# EAGLE design 3_ESC_BOARD (EAGLE 8.3.2)
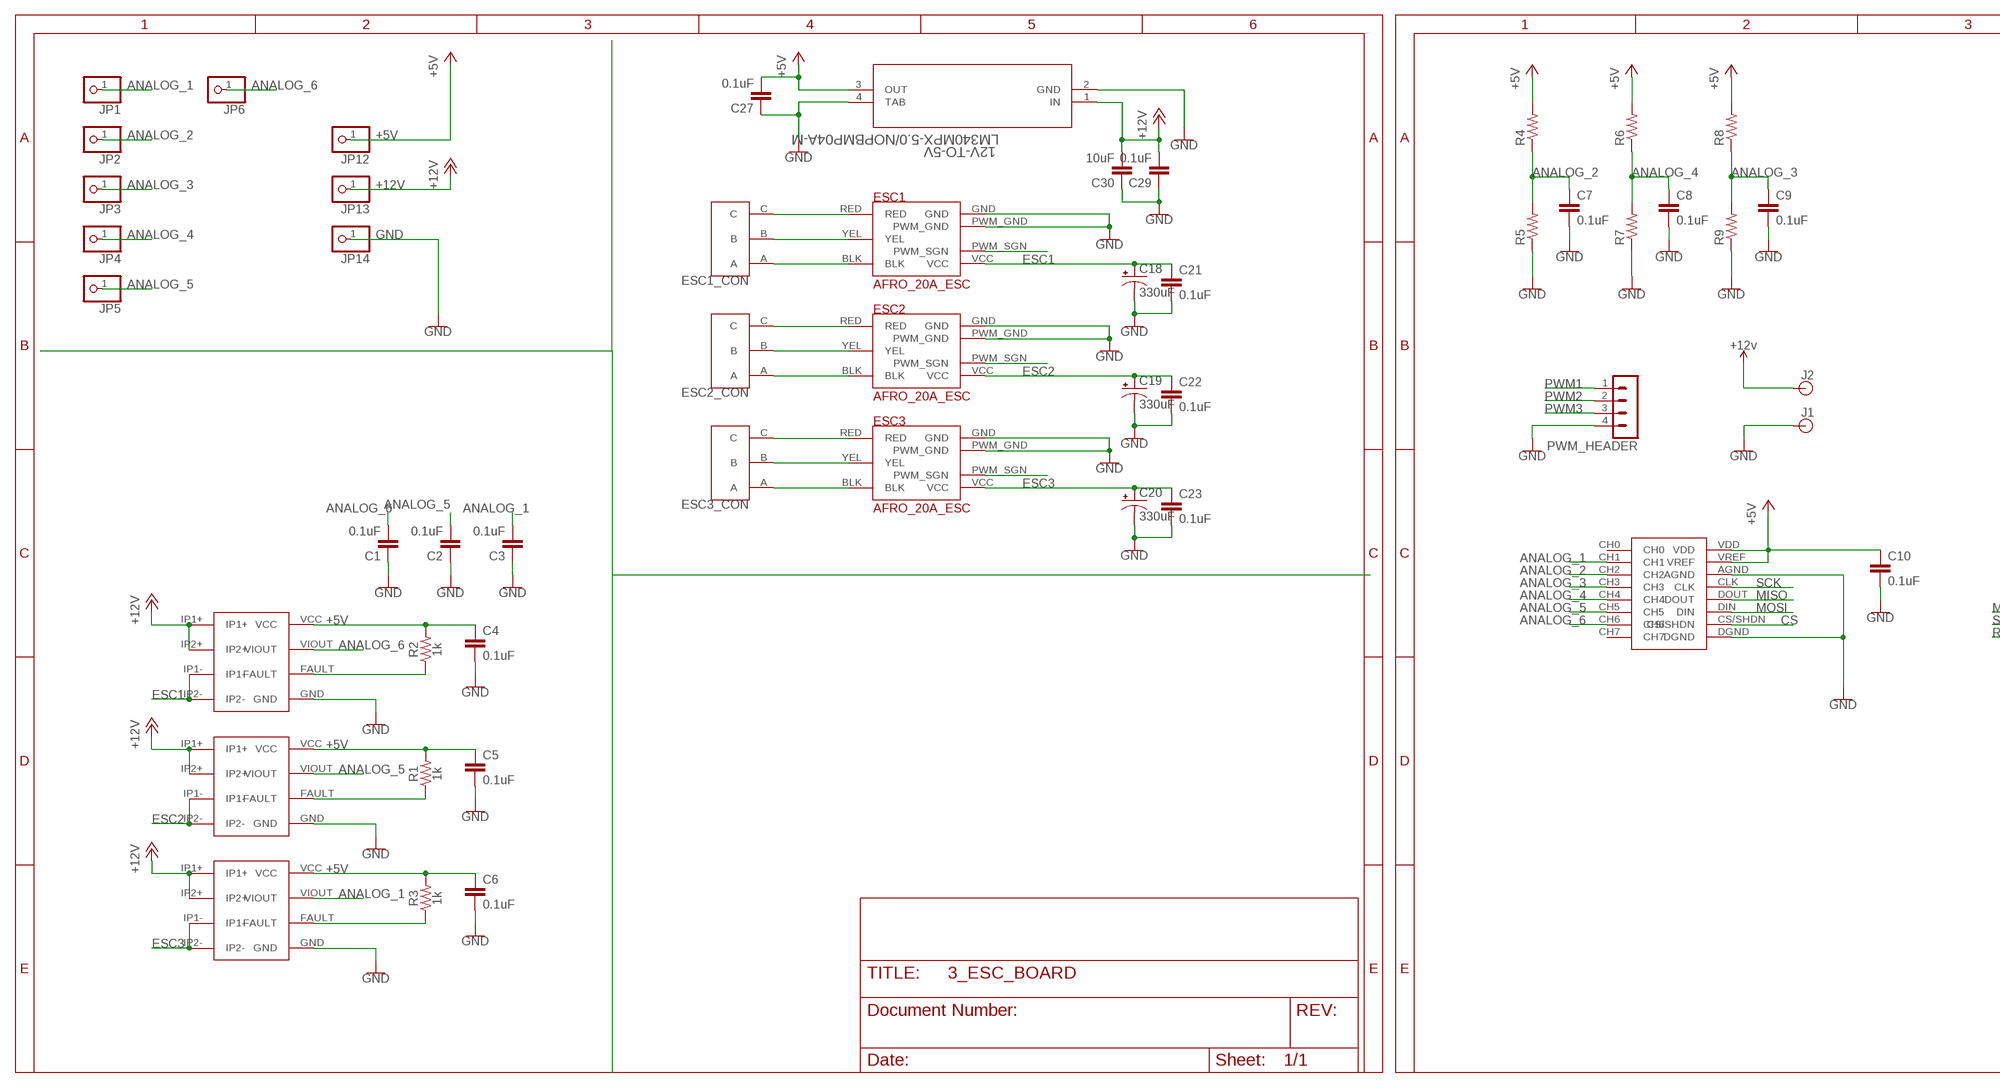
[diagram p0: schematic, sheet 1, part 1 of 3]
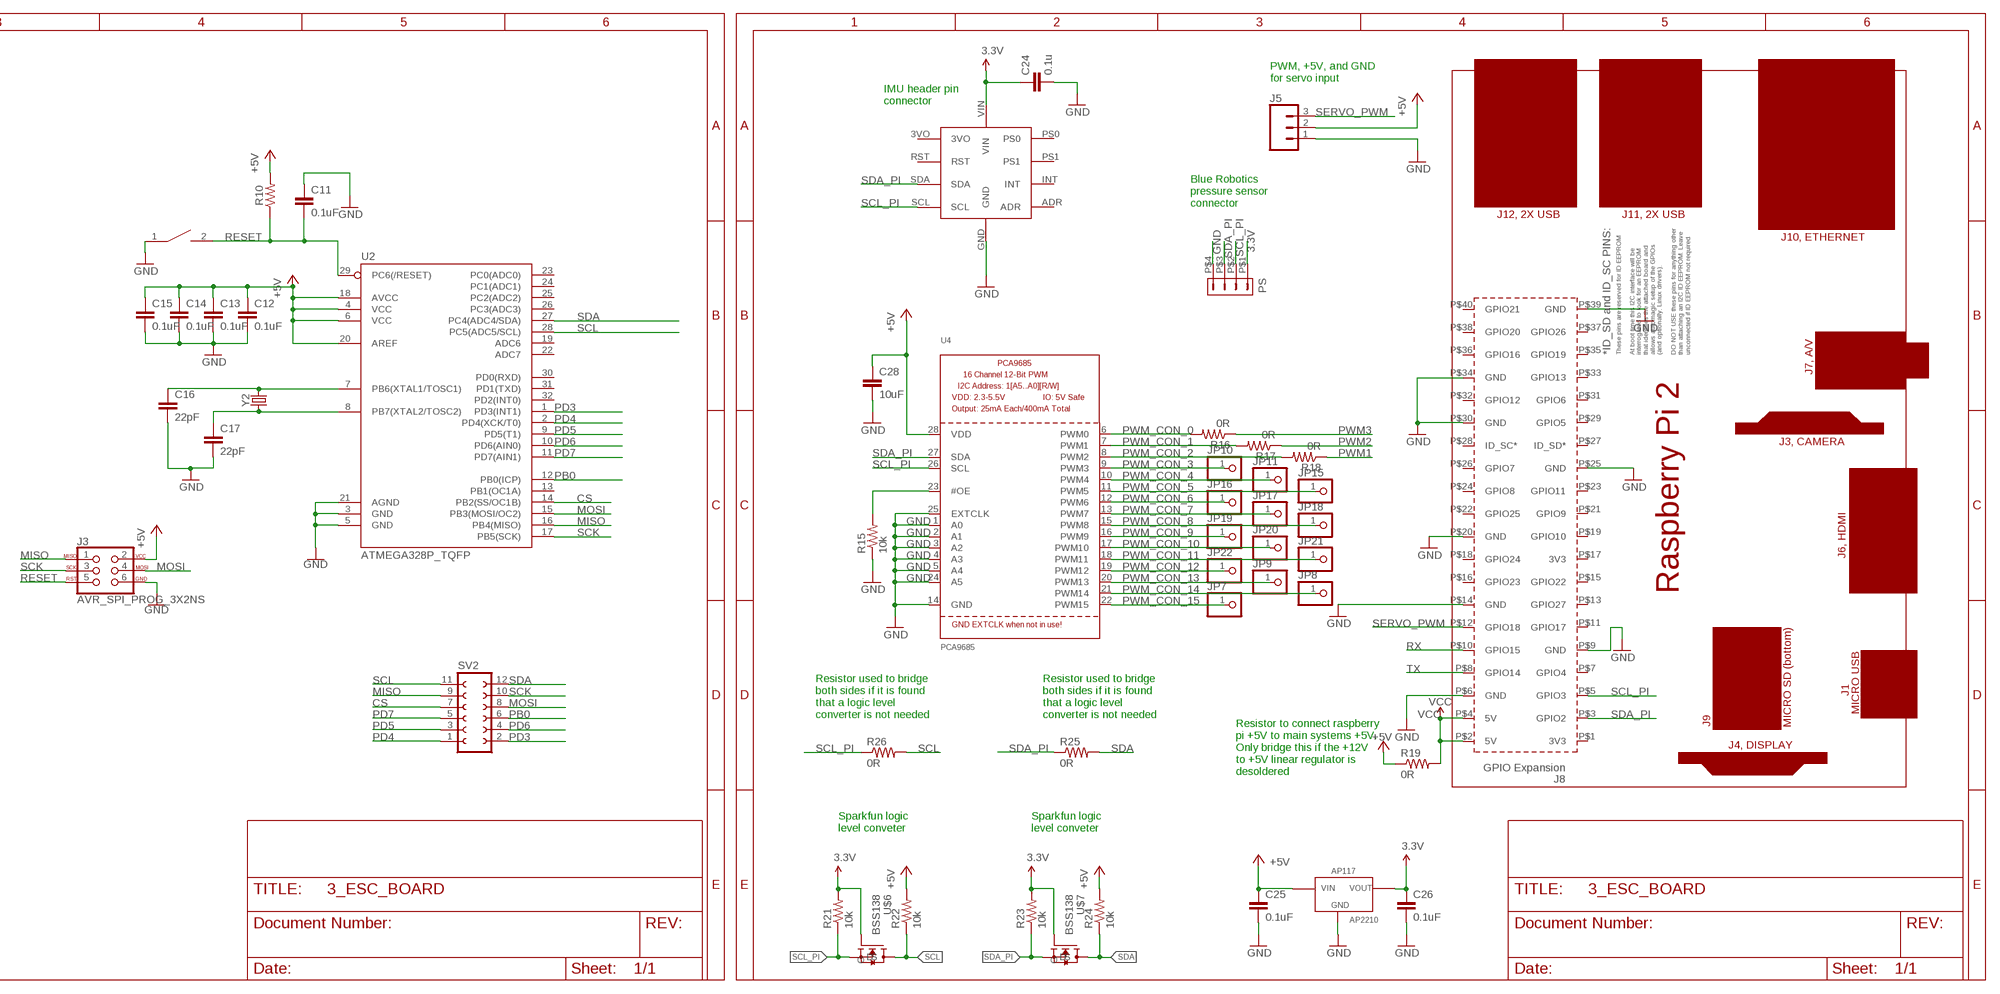
[diagram p1: schematic, sheet 1, part 2 of 3]
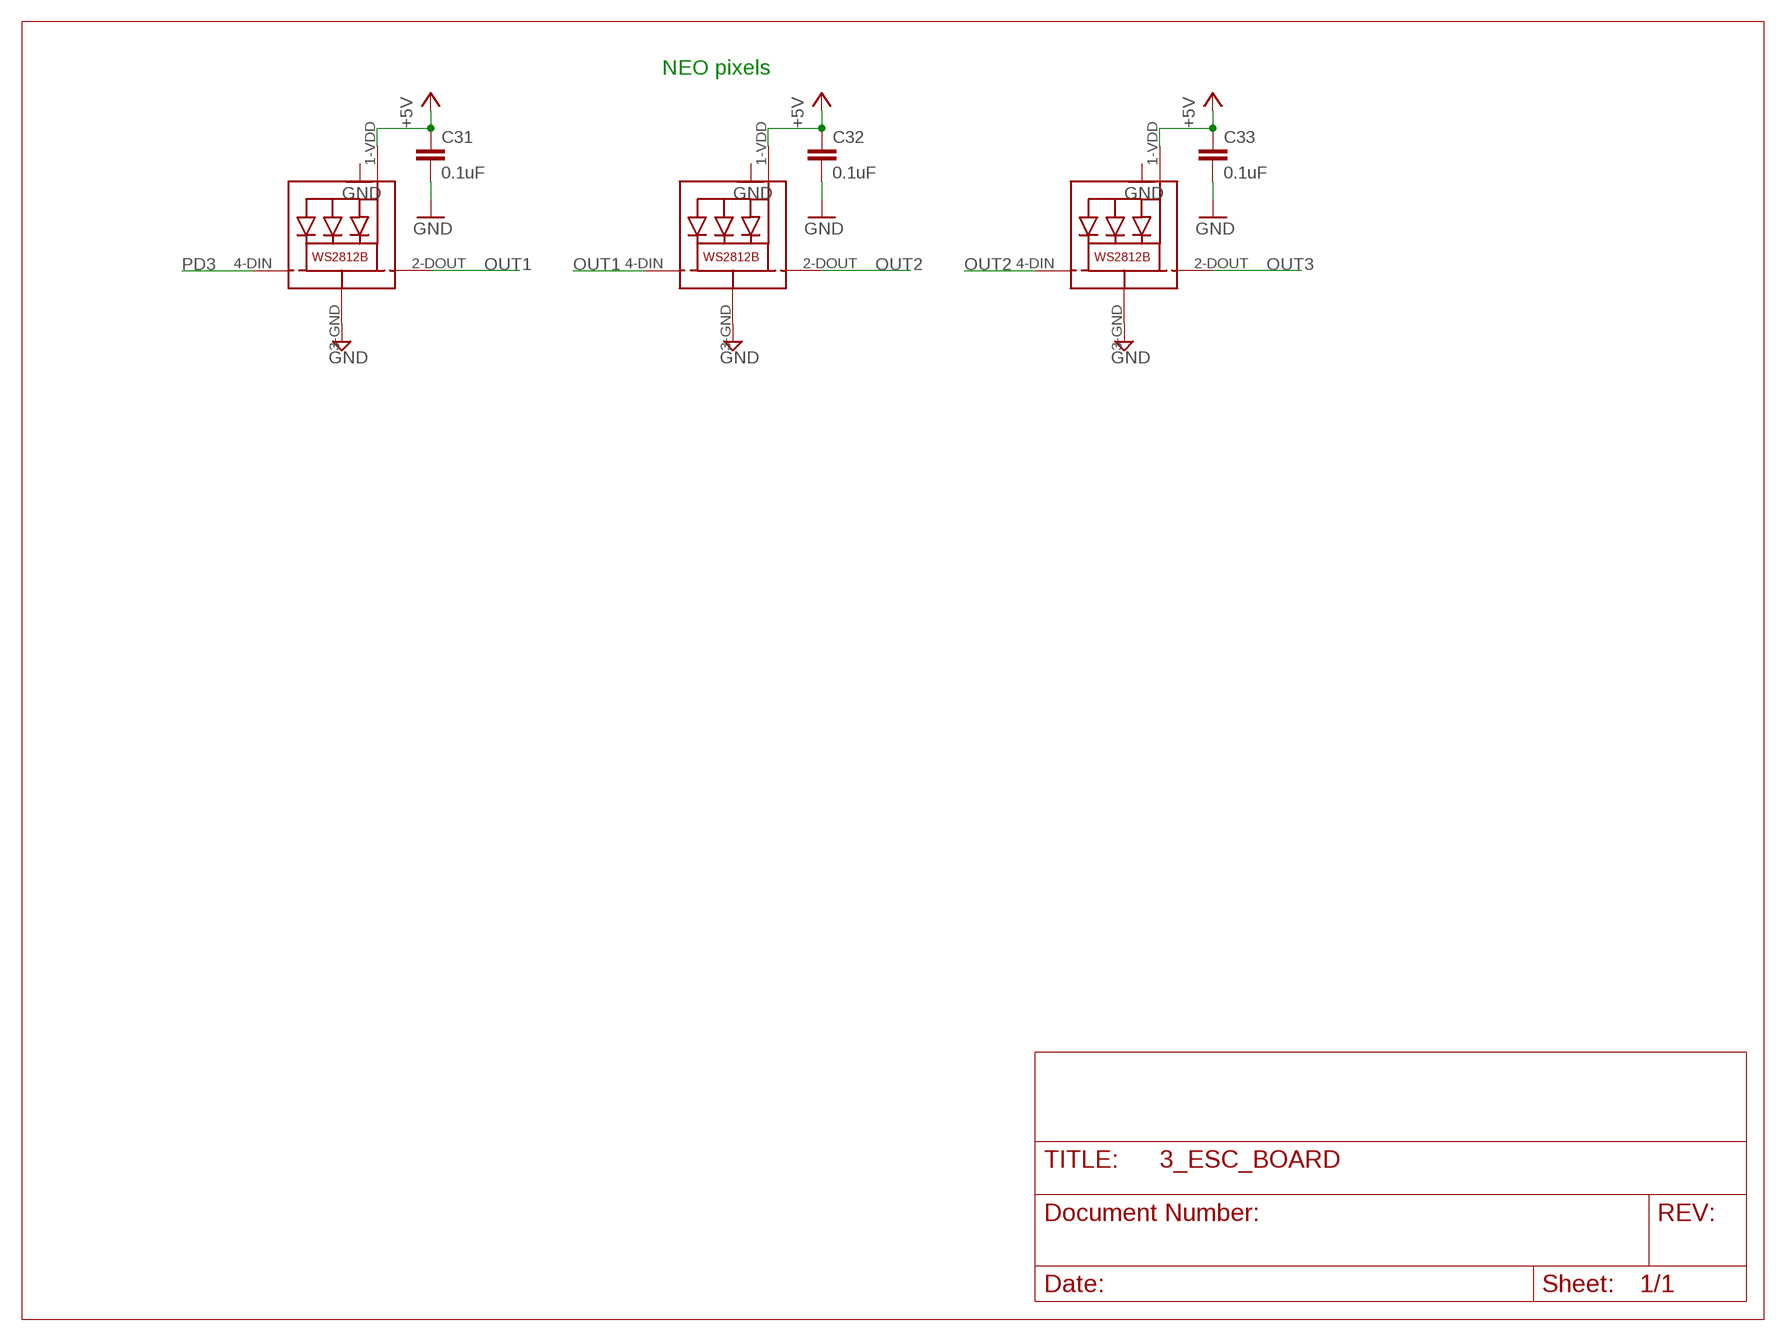
[diagram p2: schematic, sheet 1, part 3 of 3]

## Parts
12V-TO-5V  LM340MPX-5.0/NOPBMP04A-M  [MP04A-M]
C1  0.1uF  0.1UF-0603-25V-(+80/-20%)  [0603]
C2  0.1uF  0.1UF-0603-25V-(+80/-20%)  [0603]
C3  0.1uF  0.1UF-0603-25V-(+80/-20%)  [0603]
C4  0.1uF  0.1UF-0603-25V-(+80/-20%)  [0603]
C5  0.1uF  0.1UF-0603-25V-(+80/-20%)  [0603]
C6  0.1uF  0.1UF-0603-25V-(+80/-20%)  [0603]
C7  0.1uF  0.1UF-0603-25V-(+80/-20%)  [0603]
C8  0.1uF  0.1UF-0603-25V-(+80/-20%)  [0603]
C9  0.1uF  0.1UF-0603-25V-(+80/-20%)  [0603]
C10  0.1uF  0.1UF-0603-25V-(+80/-20%)  [0603]
C11  0.1uF  C-EUC0603  [C0603]
C12  0.1uF  C-EUC0603  [C0603]
C13  0.1uF  C-EUC0603  [C0603]
C14  0.1uF  C-EUC0603  [C0603]
C15  0.1uF  C-EUC0603  [C0603]
C16  22pF  C-EUC0603  [C0603]
C17  22pF  C-EUC0603  [C0603]
C18  330uF  C-ALUMINUM(330UF)  [CPOL-US(10.3_10.3MM)]
C19  330uF  C-ALUMINUM(330UF)  [CPOL-US(10.3_10.3MM)]
C20  330uF  C-ALUMINUM(330UF)  [CPOL-US(10.3_10.3MM)]
C21  0.1uF  0.1UF-0603-25V-(+80/-20%)  [0603]
C22  0.1uF  0.1UF-0603-25V-(+80/-20%)  [0603]
C23  0.1uF  0.1UF-0603-25V-(+80/-20%)  [0603]
C24  0.1u  CAP0603-CAP  [0603-CAP]
C25  0.1uF  0.1UF-0603-25V-(+80/-20%)  [0603]
C26  0.1uF  0.1UF-0603-25V-(+80/-20%)  [0603]
C27  0.1uF  0.1UF-0603-25V-(+80/-20%)  [0603]
C28  10uF  0.1UF-25V(+80/-20%)(0603)  [0603-CAP]
C29  0.1uF  0.1UF-0603-25V-(+80/-20%)  [0603]
C30  10uF  0.1UF-0603-25V-(+80/-20%)  [0603]
C31  0.1uF  C-EUC0603  [C0603]
C32  0.1uF  C-EUC0603  [C0603]
C33  0.1uF  C-EUC0603  [C0603]
ESC1  AFRO_20A_ESC  [AFRO_20A_ESC]
ESC1_CON  3PINCONNECTOR  [3PINCONNECTOR]
ESC2  AFRO_20A_ESC  [AFRO_20A_ESC]
ESC2_CON  3PINCONNECTOR  [3PINCONNECTOR]
ESC3  AFRO_20A_ESC  [AFRO_20A_ESC]
ESC3_CON  3PINCONNECTOR  [3PINCONNECTOR]
J1  BANANA_CONN  [BANANA_CONN]
J2  BANANA_CONN  [BANANA_CONN]
J3  AVR_SPI_PROG_3X2NS  [2X3-NS]
J5  CONN_03  [1X03]
JP1  PINHD-1X1  [1X01]
JP2  PINHD-1X1  [1X01]
JP3  PINHD-1X1  [1X01]
JP4  PINHD-1X1  [1X01]
JP5  PINHD-1X1  [1X01]
JP6  PINHD-1X1  [1X01]
JP7  PINHD-1X1  [1X01]
JP8  PINHD-1X1  [1X01]
JP9  PINHD-1X1  [1X01]
JP10  PINHD-1X1  [1X01]
JP11  PINHD-1X1  [1X01]
JP12  PINHD-1X1  [1X01]
JP13  PINHD-1X1  [1X01]
JP14  PINHD-1X1  [1X01]
JP15  PINHD-1X1  [1X01]
JP16  PINHD-1X1  [1X01]
JP17  PINHD-1X1  [1X01]
JP18  PINHD-1X1  [1X01]
JP19  PINHD-1X1  [1X01]
JP20  PINHD-1X1  [1X01]
JP21  PINHD-1X1  [1X01]
JP22  PINHD-1X1  [1X01]
LED1  WS2812B5050  [WS2812B]
LED2  WS2812B5050  [WS2812B]
LED3  WS2812B5050  [WS2812B]
PCB1  RPI2  [RPI2]
PS  DF13-4P-1.25DSA  [DF13-4P-1.25DSA]
PWM_HEADER  MA04-1  [MA04-1]
R1  1k  1KOHM-0603-1/10W-1%  [0603]
R2  1k  1KOHM-0603-1/10W-1%  [0603]
R3  1k  1KOHM-0603-1/10W-1%  [0603]
R4  R-US_R0603  [R0603]
R5  R-US_R0603  [R0603]
R6  R-US_R0603  [R0603]
R7  R-US_R0603  [R0603]
R8  R-US_R0603  [R0603]
R9  R-US_R0603  [R0603]
R10  RESISTOR0603  [0603]
R15  10k  470OHM1/10W1%(0603)  [0603-RES]
R16  0R  470OHM1/10W1%(0603)  [0603-RES]
R17  0R  470OHM1/10W1%(0603)  [0603-RES]
R18  0R  470OHM1/10W1%(0603)  [0603-RES]
R19  0R  RESISTOR0603-RES  [0603-RES]
R21  10k  R-US_R0603  [R0603]
R22  10k  R-US_R0603  [R0603]
R23  10k  R-US_R0603  [R0603]
R24  10k  R-US_R0603  [R0603]
R25  0R  RESISTOR0603-RES  [0603-RES]
R26  0R  RESISTOR0603-RES  [0603-RES]
RESET  SWITCH  [SW_2512]
SV2  FE06-2  [FE06-2]
U2  ATMEGA328P_TQFP  [TQFP32-08]
U4  PCA9685  [TSSOP28]
U$1  ACS711  [ACS711]
U$2  ACS711  [ACS711]
U$3  ACS711  [ACS711]
U$4  MCP3008  [MCP3008]
U$5  BNO055_9DOF_BREAKOUT  [BNO055]
U$6  BSS138  [BSS138]
U$7  BSS138  [BSS138]
U$8  AP2210  [SOT-23-3]
Y2  CRYSTALPTH-HC49US  [HC49US]

## Nets
3.3V: C24.1 C26.1 PS.P$1 R21.2 R23.2 U$5.VIN U$6.G U$7.G U$8.VOUT
+5V: 12V-TO-5V.3(OUT) C4.1 C5.1 C6.1 C10.1 C12.1 C13.1 C14.1 C15.1 C25.1 C27.2 C28.1 C31.1 C32.1 C33.1 J3.2 J5.2 JP12.1 LED1.1-VDD(VDD) LED2.1-VDD(VDD) LED3.1-VDD(VDD) R1.2 R2.2 R3.2 R4.2 R6.2 R8.2 R10.2 R19.1 R22.2 R24.2 U2.4(VCC) U2.6(VCC) U2.18(AVCC) U2.20(AREF) U4.28(VDD) U$1.VCC U$2.VCC U$3.VCC U$4.VDD U$4.VREF U$8.VIN
+12V: 12V-TO-5V.1(IN) C29.2 C30.2 J2.P$1 JP13.1 U$1.IP1+ U$1.IP2+ U$2.IP1+ U$2.IP2+ U$3.IP1+ U$3.IP2+ ; supply symbol labelled +12v
ANALOG_1: C3.2 JP1.1 U$3.VIOUT U$4.CH1
ANALOG_2: C7.1 JP2.1 R4.1 R5.2 U$4.CH2
ANALOG_3: C9.1 JP3.1 R8.1 R9.2 U$4.CH3
ANALOG_4: C8.1 JP4.1 R6.1 R7.2 U$4.CH4
ANALOG_5: C2.2 JP5.1 U$2.VIOUT U$4.CH5
ANALOG_6: C1.2 JP6.1 U$1.VIOUT U$4.CH6
CS: SV2.7 U2.14(PB2(SS/OC1B)) U$4.CS/SHDN
ESC1: C18.+ C21.1 ESC1.VCC U$1.IP1- U$1.IP2-
ESC2: C19.+ C22.1 ESC2.VCC U$2.IP1- U$2.IP2-
ESC3: C20.+ C23.1 ESC3.VCC U$3.IP1- U$3.IP2-
GND: 12V-TO-5V.2(GND) 12V-TO-5V.4(TAB) C1.1 C2.1 C3.1 C4.2 C5.2 C6.2 C7.2 C8.2 C9.2 C10.2 C11.1 C12.2 C13.2 C14.2 C15.2 C16.2 C17.2 C18.- C19.- C20.- C21.2 C22.2 C23.2 C24.2 C25.2 C26.2 C27.1 C28.2 C29.1 C30.1 C31.2 C32.2 C33.2 ESC1.GND ESC1.PWM_GND ESC2.GND ESC2.PWM_GND ESC3.GND ESC3.PWM_GND J1.P$1 J3.6 J5.1 JP14.1 LED1.3-GND(GND) LED2.3-GND(GND) LED3.3-GND(GND) PCB1.P$6(GND) PCB1.P$9(GND) PCB1.P$14(GND) PCB1.P$20(GND) PCB1.P$25(GND) PCB1.P$30(GND) PCB1.P$34(GND) PCB1.P$39(GND) PS.P$4 PWM_HEADER.4 R5.1 R7.1 R9.1 R15.1 RESET.1 U2.3(GND) U2.5(GND) U2.21(AGND) U4.1(A0) U4.2(A1) U4.3(A2) U4.4(A3) U4.5(A4) U4.14(GND) U4.24(A5) U4.25(EXTCLK) U$1.GND U$2.GND U$3.GND U$4.AGND U$4.DGND U$5.GND U$8.GND
MISO: J3.1 SV2.9 U2.16(PB4(MISO)) U$4.DOUT
MOSI: J3.4 SV2.8 U2.15(PB3(MOSI/OC2)) U$4.DIN
N$1: ESC2.RED ESC2_CON.C
N$2: R2.1 U$1.FAULT
N$3: ESC2.YEL ESC2_CON.B
N$4: R1.1 U$2.FAULT
N$5: ESC2.BLK ESC2_CON.A
N$6: R3.1 U$3.FAULT
N$7: ESC1.RED ESC1_CON.C
N$8: ESC1.YEL ESC1_CON.B
N$9: ESC1.BLK ESC1_CON.A
N$10: ESC3.RED ESC3_CON.C
N$11: ESC3.YEL ESC3_CON.B
N$12: ESC3.BLK ESC3_CON.A
N$14: C16.1 U2.7(PB6(XTAL1/TOSC1)) Y2.2
N$15: C17.1 U2.8(PB7(XTAL2/TOSC2)) Y2.1
N$35: R15.2 U4.23(#OE)
OUT1: LED1.2-DOUT(DO) LED2.4-DIN(DI)
OUT2: LED2.2-DOUT(DO) LED3.4-DIN(DI)
OUT3: LED3.2-DOUT(DO)
PB0: SV2.6 U2.12(PB0(ICP))
PD3: LED1.4-DIN(DI) SV2.2 U2.1(PD3(INT1))
PD4: SV2.1 U2.2(PD4(XCK/T0))
PD5: SV2.3 U2.9(PD5(T1))
PD6: SV2.4 U2.10(PD6(AIN0))
PD7: SV2.5 U2.11(PD7(AIN1))
PWM1: ESC1.PWM_SGN PWM_HEADER.1 R18.1
PWM2: ESC2.PWM_SGN PWM_HEADER.2 R17.1
PWM3: ESC3.PWM_SGN PWM_HEADER.3 R16.1
PWM_CON_0: R16.2 U4.6(PWM0)
PWM_CON_1: R17.2 U4.7(PWM1)
PWM_CON_2: R18.2 U4.8(PWM2)
PWM_CON_3: JP10.1 U4.9(PWM3)
PWM_CON_4: JP11.1 U4.10(PWM4)
PWM_CON_5: JP15.1 U4.11(PWM5)
PWM_CON_6: JP16.1 U4.12(PWM6)
PWM_CON_7: JP17.1 U4.13(PWM7)
PWM_CON_8: JP18.1 U4.15(PWM8)
PWM_CON_9: JP19.1 U4.16(PWM9)
PWM_CON_10: JP20.1 U4.17(PWM10)
PWM_CON_11: JP21.1 U4.18(PWM11)
PWM_CON_12: JP22.1 U4.19(PWM12)
PWM_CON_13: JP9.1 U4.20(PWM13)
PWM_CON_14: JP8.1 U4.21(PWM14)
PWM_CON_15: JP7.1 U4.22(PWM15)
RESET: C11.2 J3.5 R10.1 RESET.2 U2.29(PC6(/RESET))
RX: PCB1.P$10(GPIO15)
SCK: J3.3 SV2.10 U2.17(PB5(SCK)) U$4.CLK
SCL: R22.1 R26.2 SV2.11 U2.28(PC5(ADC5/SCL)) U$6.D
SCL_PI: PCB1.P$5(GPIO3) PS.P$2 R21.1 R26.1 U4.26(SCL) U$5.SCL U$6.S
SDA: R24.1 R25.2 SV2.12 U2.27(PC4(ADC4/SDA)) U$7.D
SDA_PI: PCB1.P$3(GPIO2) PS.P$3 R23.1 R25.1 U4.27(SDA) U$5.SDA U$7.S
SERVO_PWM: J5.3 PCB1.P$12(GPIO18)
TX: PCB1.P$8(GPIO14)
VCC: PCB1.P$2(5V) PCB1.P$4(5V) R19.2
Unconnected: PCB1.P$1(3V3) PCB1.P$7(GPIO4) PCB1.P$11(GPIO17) PCB1.P$13(GPIO27) PCB1.P$15(GPIO22) PCB1.P$16(GPIO23) PCB1.P$17(3V3) PCB1.P$18(GPIO24) PCB1.P$19(GPIO10) PCB1.P$21(GPIO9) PCB1.P$22(GPIO25) PCB1.P$23(GPIO11) PCB1.P$24(GPIO8) PCB1.P$26(GPIO7) PCB1.P$27(ID_SD*) PCB1.P$28(ID_SC*) PCB1.P$29(GPIO5) PCB1.P$31(GPIO6) PCB1.P$32(GPIO12) PCB1.P$33(GPIO13) PCB1.P$35(GPIO19) PCB1.P$36(GPIO16) PCB1.P$37(GPIO26) PCB1.P$38(GPIO20) PCB1.P$40(GPIO21) U2.13(PB1(OC1A)) U2.19(ADC6) U2.22(ADC7) U2.23(PC0(ADC0)) U2.24(PC1(ADC1)) U2.25(PC2(ADC2)) U2.26(PC3(ADC3)) U2.30(PD0(RXD)) U2.31(PD1(TXD)) U2.32(PD2(INT0)) U$4.CH0 U$4.CH7 U$5.3VO U$5.ADR U$5.INT U$5.PS0 U$5.PS1 U$5.RST

## Notes on the sheet
- PWM, +5V, and GND
  for servo input
- IMU header pin
  connector
- NEO pixels
- Blue Robotics 
  pressure sensor
  connector
- Resistor used to bridge
  both sides if it is found
  that a logic level 
  converter is not needed
- Resistor used to bridge
  both sides if it is found
  that a logic level 
  converter is not needed
- Resistor to connect raspberry
  pi +5V to main systems +5V.
  Only bridge this if the +12V
  to +5V linear regulator is 
  desoldered
- Sparkfun logic
  level conveter
- Sparkfun logic
  level conveter

## Library data of the parts
12V-TO-5V = 12v_to_5v_linreg:LM340MPX-5.0/NOPB; MANUFACTURER_PART_NUMBER: LM340MPX5.0NOPB; VENDOR: National Semiconductor
C1-C10 C21-C23 C25-C27 C29 = SparkFun-Capacitors:0.1UF: 0.1µF ceramic capacitors A capacitor is a passive two-terminal electrical component used to store electrical energy temporarily in an electric field.; PROD_ID: CAP-00810
C11-C17 C31-C33 = rcl:C-EU: CAPACITOR, European symbol
C18-C20 = PowerComponents:C-ALUMINUM(330UF)
C24 = SparkFun-Passives:CAP: Capacitor Standard 0603 ceramic capacitor, and 0.1" leaded capacitor.
C28 = SparkFun-Capacitors:0.1UF-25V(+80/-20%)(0603): CAP-00810 Ceramic Standard decoupling cap; PROD_ID: CAP-00810; VALUE: 0.1uF
C30 = SparkFun-Capacitors:0.1UF: 0.1µF ceramic capacitors A capacitor is a passive two-terminal electrical component used to store electrical energy temporarily in an electric field.; PROD_ID: CAP-00810; VALUE: 0.1uF
ESC1-ESC3 = afro_20A_esc:AFRO_20A_ESC
ESC1_CON ESC2_CON ESC3_CON = afro_20A_esc:3PINCONNECTOR
J1 J2 = SparkFun-Connectors:BANANA_CONN: Through-hole Banana Jack Basic PTH connection for banana jack plugs SparkFun Products: Multimeter Kit <https://www.sparkfun.com/products/retired/10956> Banana to Alligator Cable <https://www.sparkfun.com/products/retired/509> Banana to Alligator Coax Cable <https://www.sparkfun.com/products/retired/508> Banana to Banana Cable <https://www.sparkfun.com/products/retired/507> Banana to IC Hook Cables <https://www.sparkfun.com/products/retired/506>
J3 = SparkFun-Connectors:AVR_SPI_PROG_3X2: AVR ISP 6 Pin This is the reduced ISP connector for AVR programming. Common on Arduino. This footprint will take up less PCB space and can be used with a 10-pin to 6-pin adapter such as SKU: BOB-08508 **Special note about "TEST_POINT" package. The stop mask is on the top side, so if you want your programming test points to be on the bottom of your board, make sure to place this package on the bottom side of the board. This also ensure that the orientation to program from the bottom side will be correct. SparkFun Products: SparkFun ISP Pogo Adapter <https://www.sparkfun.com/products/11591> - NS Tiny AVR Programmer <https://www.sparkfun.com/products/11801> -PTH
J5 = SparkFun-Connectors:CONN_03: Multi connection point. Often used as Generic Header-pin footprint for 0.1 inch spaced/style header connections On any of the 0.1 inch spaced packages, you can populate with these: Break Away Headers - Straight <https://www.sparkfun.com/products/116> (PRT-00116) Break Away Male Headers - Right Angle <https://www.sparkfun.com/products/553> (PRT-00553) Female Headers <https://www.sparkfun.com/products/115> (PRT-00115) Break Away Headers - Machine Pin <https://www.sparkfun.com/products/117> (PRT-00117) Break Away Female Headers - Swiss Machine Pin <https://www.sparkfun.com/products/743> (PRT-00743) Stackable Header - 3 Pin (Female, 0.1") <https://www.sparkfun.com/products/13875> (PRT-13875) For SCREWTERMINALS and SPRING TERMINALS visit here: Screw Terimnals on SparkFun.com <https://www.sparkfun.com/search/results?term=Screw+Terminals> (5mm/3.5mm/2.54mm spacing) This device is also useful as a general connection point to wire up your design to another part of your project. Our various solder wires solder well into these plated through hole pads. Hook-Up Wire - Assortment (Stranded, 22 AWG) <https://www.sparkfun.com/products/11375> (PRT-11375) Hook-Up Wire - Assortment (Solid Core, 22 AWG) <https://www.sparkfun.com/products/11367> (PRT-11367) View the entire wire category on our website here <https://www.sparkfun.com/categories/141> Special notes: Molex polarized connector foot print use with SKU : PRT-08232 with associated crimp pins and housings.
JP1-JP22 = pinhead:PINHD-1X1: PIN HEADER
LED1-LED3 = microbuilder:WS2812B5050
PCB1 = MicrocontrollerComponents:RPI2: Device for Raspberry Pi 2 board created by www.element14.com More information and support community is available at http://www.element14.com/community/community/raspberry-pi/raspberrypi2
PS = con-hirose-df13:DF13-4P-1.25: DF13-4P 1.25mm Pitch Miniature Crimping Connector.
PWM_HEADER = con-lstb:MA04-1: PIN HEADER; OC_FARNELL: unknown; OC_NEWARK: unknown
R1-R3 = SparkFun-Resistors:1KOHM: 1kΩ resistor A resistor is a passive two-terminal electrical component that implements electrical resistance as a circuit element. Resistors act to reduce current flow, and, at the same time, act to lower voltage levels within circuits. - Wikipedia; PROD_ID: RES-07856
R4-R9 R21-R24 = rcl:R-US_: RESISTOR, American symbol
R10 = SparkFun-Resistors:RESISTOR: Generic Resistor Package
R15-R18 = SparkFun-Resistors:470OHM1/10W1%(0603): RES-07869; PROD_ID: RES-07869; VALUE: 470
R19 R25 R26 = SparkFun-Passives:RESISTOR: Resistor Basic schematic elements and footprints for 0603, 1206, and PTH resistors.
RESET = DiscreteComponents:SWITCH
SV2 = con-lsta:FE06-2: FEMALE HEADER; OC_FARNELL: unknown; OC_NEWARK: unknown
U2 = SparkFun-IC-Microcontroller:ATMEGA328P_TQFP: Popular 328P in QFP Storefront component: ATmega328 - TQFP <https://www.sparkfun.com/products/13448> (COM-13448) Datasheet <http://www.sparkfun.com/datasheets/Components/SMD/ATMega328.pdf> SparkFun Products SparkFun RedBoard - Programmed with Arduino <https://www.sparkfun.com/products/12757> (DEV-12757) Arduino Pro Mini 328 - 5V/16MHz <https://www.sparkfun.com/products/11113> (DEV-11113) Arduino Pro Mini 328 - 3.3V/8MHz <https://www.sparkfun.com/products/11114> (DEV-11114) SparkFun OpenLog <https://www.sparkfun.com/products/13712> (DEV-13712) SparkFun MicroView - OLED Arduino Module <https://www.sparkfun.com/products/12923> (DEV-12923) SparkFun Digital Sandbox <https://www.sparkfun.com/products/12651> (DEV-12651) SparkFun PicoBoard <https://www.sparkfun.com/products/11888> (WIG-11888) Arduino Fio <https://www.sparkfun.com/products/10116> (DEV-10116) LilyPad Arduino 328 Main Board <https://www.sparkfun.com/products/13342> (DEV-13342) SparkFun RedStick <https://www.sparkfun.com/products/13741> (DEV-13741) LilyPad MP3 <https://www.sparkfun.com/products/11013> (DEV-11013) LilyPad Arduino SimpleSnap <https://www.sparkfun.com/products/10941> (DEV-10941) SparkFun Stepoko <https://www.sparkfun.com/products/13899> (ROB-13899) SparkFun Geiger Counter <https://www.sparkfun.com/products/11345> (SEN-11345) SparkFun EL Sequencer <https://www.sparkfun.com/products/12781> (COM-12781) Arduino Pro 328 - 5V/16MHz <https://www.sparkfun.com/products/10915> (DEV-10915) CryptoCape <https://www.sparkfun.com/products/12773> (DEV-12773) SparkFun IR Thermometer Evaluation Board - MLX90614 <https://www.sparkfun.com/products/10740> (SEN-10740) SparkFun RedBot Mainboard <https://www.sparkfun.com/products/12097> (ROB-12097) Arduino Pro 328 - 3.3V/8MHz <https://www.sparkfun.com/products/10914> (DEV-10914) SparkFun Block for Intel® Edison - Arduino <https://www.sparkfun.com/products/13036> (DEV-13036) SparkFun Simon Says - Surface Mount Soldering Kit <https://www.sparkfun.com/products/10935> (KIT-10935) SparkFun 7-Segment Serial Display - Red <https://www.sparkfun.com/products/11441> (COM-11441) SparkFun 7-Segment Serial Display - White <https://www.sparkfun.com/products/11629> (COM-11629) SparkFun 7-Segment Serial Display - Yellow <https://www.sparkfun.com/products/11443> (COM-11443) SparkFun 7-Segment Serial Display - Kelly Green <https://www.sparkfun.com/products/11440> (COM-11440) SparkFun 7-Segment Serial Display - Blue <https://www.sparkfun.com/products/11442> (COM-11442) SparkFun OpenSegment Serial Display - 20mm (Blue) <https://www.sparkfun.com/products/11647> (COM-11647) SparkFun OpenSegment Serial Display - 20mm (Green) <https://www.sparkfun.com/products/11646> (COM-11646) SparkFun OpenSegment Serial Display - 20mm (White) <https://www.sparkfun.com/products/11648> (COM-11648) SparkFun OpenSegment Serial Display - 20mm (Red) <https://www.sparkfun.com/products/11644> (COM-11644) SparkFun OpenSegment Serial Display - 20mm (Yellow) <https://www.sparkfun.com/products/11645> (COM-11645) SparkFun OpenSegment Shield <https://www.sparkfun.com/products/13190> (DEV-13190); PROD_ID: IC-09069
U4 = microbuilder:PCA9685: PCA9685 - 16 Channel 12-Bit I2C PWM Controller 5.0V tolerant 16 channel, 12-bit I2C PWM controller with 25mA per output (max. 400mA total) Digikey: 568-5931-1-ND
U$1-U$3 = ACS711_ameter:ACS711
U$4 = MCP3008:MCP3008
U$5 = Other:BNO055_9DOF_BREAKOUT
U$6 U$7 = BSS138:BSS138: BSS138 N-Channel Logic Level Enhancement Mode Field Effect Transistor
U$8 = PowerComponents:AP2210
Y2 = SparkFun-Clocks:CRYSTAL: Crystals (Generic) These are passive quartz crystals, which can be used as a clock source for a microcontroller. Crystal's are two-terminal devices. They require external "load" capacitors to generate an oscillating signal.

## Board
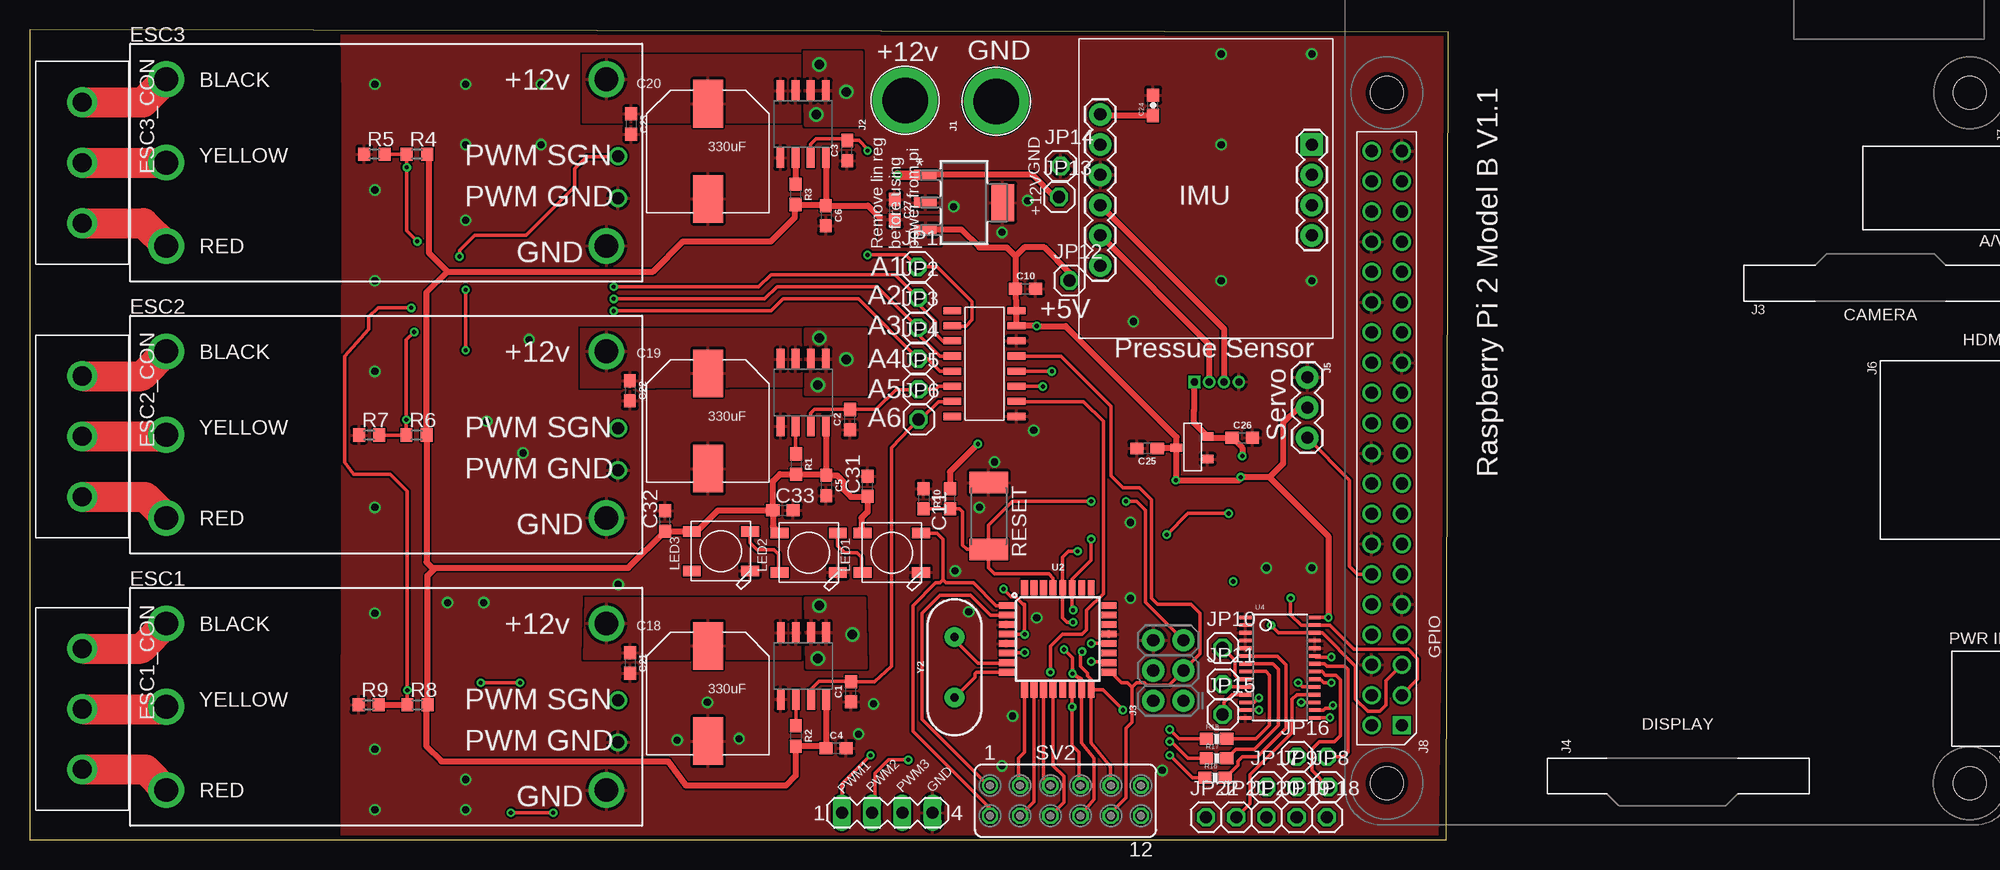
[diagram p3: board, top side]
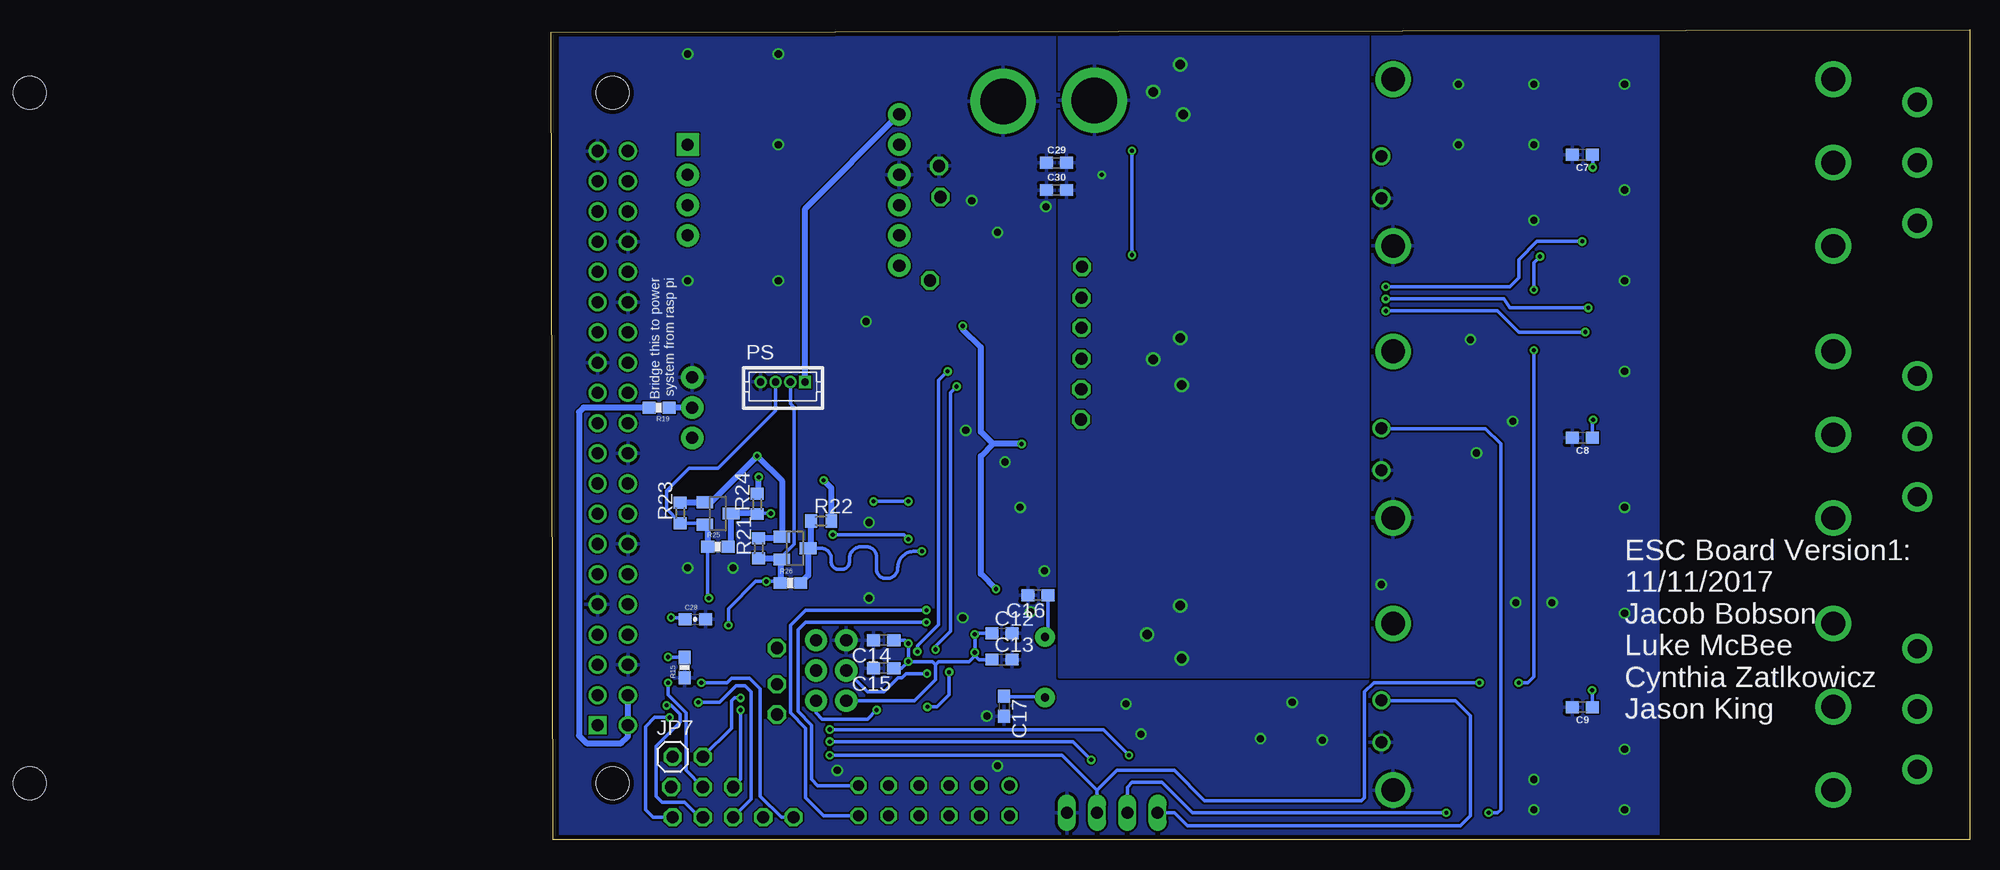
[diagram p4: board, bottom side, seen from below]

Size 119.25 x 68.06 mm. Coordinates in mm from the lower left corner, seen from the top.
Outline: 0,0 119.05,0 119.25,67.86 0,68.06 0,0
Copper layers (1*16): Top 0.0356mm / dielectric 1.5011mm / Bottom 0.0356mm
Design rules "LaenPCBOrder": minimum track width 6mil, minimum drill 13mil, track to track 6mil, track to pad 6mil, pad to pad 6mil, via to via 6mil, smd to smd 6mil, copper to edge 15mil, drill to drill 6mil, minimum pad ring 7mil, minimum via ring 7mil, stop-mask expansion 3mil, vias tented up to drill 0mil, thermal gap 10mil

### Footprints (pad centres in the part's own frame; a part is rotated, then mirrored left to right if it is on the bottom)
MP04A-M = smd 1.905 x 0.889: 1 -3.251,2.3; 2 -3.251,0; 3 -3.251,-2.3 | smd 1.905 x 3.099: 4 3.251,0
0603 = smd 1.1 x 1: 1 -0.85,0; 2 0.85,0
C0603 = smd 1.1 x 1: 1 -0.85,0; 2 0.85,0
CPOL-US(10.3_10.3MM) = smd 2.5 x 4: + 0,4; - 0,-4
0603-CAP = smd 1.1 x 1: 1 -0.85,0; 2 0.85,0
AFRO_20A_ESC = drill 2: BLK -18,7; GND 19,-7; RED -18,-7; VCC 19,7; YEL -18,0 | drill 1: PWM_GND 20,-3; PWM_SGN 20,0.54
3PINCONNECTOR = drill 1.6 pad 2.5: A -5.08,0; B 0,0; C 5.08,0
BANANA_CONN = drill 3.81 pad 5.461: P$1 0,0
2X3-NS = drill 1.016 pad 1.88: 1 -2.54,-1.27; 2 -2.54,1.27; 3 0,-1.27; 4 0,1.27; 5 2.54,-1.27; 6 2.54,1.27
1X03 = drill 1.016 pad 1.88: 1 0,0; 2 2.54,0; 3 5.08,0
1X01 = drill 1.016 octagon: 1 0,0
WS2812B = smd 1.5 x 0.9: 1-VDD 2.45,-1.65; 2-DOUT 2.45,1.65; 3-GND -2.45,1.65; 4-DIN -2.45,-1.65
RPI2 = drill 1.016 square: P$1 8.37,51.23 | drill 1.016: P$2 8.357,53.772; P$3 10.897,51.232; P$4 10.897,53.772; P$5 13.437,51.232; P$6 13.437,53.772; P$7 15.977,51.232; P$8 15.977,53.772; P$9 18.517,51.232; P$10 18.517,53.772; P$11 21.057,51.232; P$12 21.057,53.772; P$13 23.597,51.232; P$14 23.597,53.772; P$15 26.137,51.232; P$16 26.137,53.772; P$17 28.677,51.232; P$18 28.677,53.772; P$19 31.217,51.232; P$20 31.217,53.772; P$21 33.757,51.232; P$22 33.757,53.772; P$23 36.297,51.232; P$24 36.297,53.772; P$25 38.837,51.232; P$26 38.837,53.772; P$27 41.377,51.232; P$28 41.377,53.772; P$29 43.917,51.232; P$30 43.917,53.772; P$31 46.457,51.232; P$32 46.457,53.772; P$33 48.997,51.232; P$34 48.997,53.772; P$35 51.537,51.232; P$36 51.537,53.772; P$37 54.077,51.232; P$38 54.077,53.772; P$39 56.617,51.232; P$40 56.617,53.772 | hole 2.75: 3.5,3.5; 61.5,3.5; 3.5,52.5; 61.5,52.5
DF13-4P-1.25DSA = drill 0.6 pad 1.016 square: P$1 1.875,0 | drill 0.6 pad 1.016: P$2 0.625,0; P$3 -0.625,0; P$4 -1.875,0
MA04-1 = drill 1.016 long: 1 -3.81,0; 2 -1.27,0; 3 1.27,0; 4 3.81,0
R0603 = smd 1 x 1.1: 1 -0.85,0; 2 0.85,0
0603-RES = smd 1.1 x 1: 1 -0.85,0; 2 0.85,0
SW_2512 = smd 1.8 x 3.2: 1 -2.8,0; 2 2.8,0
FE06-2 = drill 0.914: 1 -6.35,1.27 | drill 0.914 octagon: 2 -6.35,-1.27; 3 -3.81,1.27; 4 -3.81,-1.27; 5 -1.27,1.27; 6 -1.27,-1.27; 7 1.27,1.27; 8 1.27,-1.27; 9 3.81,1.27; 10 3.81,-1.27; 11 6.35,1.27; 12 6.35,-1.27
TQFP32-08 = smd 1.27 x 0.559: 1 -4.293,2.8; 2 -4.293,2; 3 -4.293,1.2; 4 -4.293,0.4; 5 -4.293,-0.4; 6 -4.293,-1.2; 7 -4.293,-2; 8 -4.293,-2.8; 17 4.293,-2.8; 18 4.293,-2; 19 4.293,-1.2; 20 4.293,-0.4; 21 4.293,0.4; 22 4.293,1.2; 23 4.293,2; 24 4.293,2.8 | smd 0.559 x 1.27: 9 -2.8,-4.293; 10 -2,-4.293; 11 -1.2,-4.293; 12 -0.4,-4.293; 13 0.4,-4.293; 14 1.2,-4.293; 15 2,-4.293; 16 2.8,-4.293; 25 2.8,4.293; 26 2,4.293; 27 1.2,4.293; 28 0.4,4.293; 29 -0.4,4.293; 30 -1.2,4.293; 31 -2,4.293; 32 -2.8,4.293
TSSOP28 = smd 0.305 x 0.991: 1 -4.225,-2.918; 2 -3.575,-2.918; 3 -2.925,-2.918; 4 -2.275,-2.918; 5 -1.625,-2.918; 6 -0.975,-2.918; 7 -0.325,-2.918; 8 0.325,-2.918; 9 0.975,-2.918; 10 1.625,-2.918; 11 2.275,-2.918; 12 2.925,-2.918; 13 3.575,-2.918; 14 4.225,-2.918; 15 4.225,2.918; 16 3.575,2.918; 17 2.925,2.918; 18 2.275,2.918; 19 1.625,2.918; 20 0.975,2.918; 21 0.325,2.918; 22 -0.325,2.918; 23 -0.975,2.918; 24 -1.625,2.918; 25 -2.275,2.918; 26 -2.925,2.918; 27 -3.575,2.918; 28 -4.225,2.918
ACS711 = smd 1.75 x 0.65: FAULT 2.8,-0.635; GND 2.8,-1.905; IP1+ -2.8,1.905; IP1- -2.8,-0.635; IP2+ -2.8,0.635; IP2- -2.8,-1.905; VCC 2.8,1.905; VIOUT 2.8,0.635
MCP3008 = smd 0.6 x 1.5: AGND -1.905,2.7; CH0 -4.445,-2.7; CH1 -3.175,-2.7; CH2 -1.905,-2.7; CH3 -0.635,-2.7; CH4 0.635,-2.7; CH5 1.905,-2.7; CH6 3.175,-2.7; CH7 4.445,-2.7; CLK -0.635,2.7; CS/SHDN 3.175,2.7; DGND 4.445,2.7; DIN 1.905,2.7; DOUT 0.635,2.7; VDD -4.445,2.7; VREF -3.175,2.7
BNO055 = drill 1.016 pad 1.88: 3VO -8.89,2.54; ADR 8.89,-5.08; GND -8.89,0; INT 8.89,-2.54; PS1 8.89,0; RST -8.89,-7.62; SCL -8.89,-5.08; SDA -8.89,-2.54; VIN -8.89,5.08 | drill 1.016 pad 1.88 square: PS0 8.89,2.54
BSS138 = smd 1 x 1.4: D 0,1.1; G -0.95,-1.1; S 0.95,-1.1
SOT-23-3 = smd 0.7 x 1: GND 0,0; VIN 0.95,2.6; VOUT 1.9,0
HC49US = drill 0.7 pad 1.651: 1 -2.54,0; 2 2.54,0

### Placement (x,y rotation side)
12V-TO-5V  78.53,53.54 0 top
C1  69.04,12.44 90 top
C2  68.94,35.3 90 top
C3  68.71,57.91 90 top
C4  67.77,7.7 0 top
C5  66.95,29.77 270 top
C6  66.91,52.44 270 top
C7  32.56,57.54 180 bottom
C8  32.56,33.77 180 bottom
C9  32.56,11.14 180 bottom
C10  83.7,46.3 0 top
C11  75.13,28.65 270 top
C12  81.34,17.34 0 bottom
C13  81.34,15.14 0 bottom
C14  91.29,16.78 180 bottom
C15  91.29,14.41 180 bottom
C16  78.31,20.55 180 bottom
C17  81.18,11.21 270 bottom
C18  57,12.29 0 top
C19  57,35.19 0 top
C20  57,57.85 0 top
C21  50.45,14.86 270 top
C22  50.44,37.73 270 top
C23  50.54,60.14 270 top
C24  94.42,61.71 90 top
C25  93.91,32.88 180 top
C26  101.91,33.77 0 top
C27  72.7,52.95 270 top
C28  107.12,18.53 0 bottom
C29  76.77,56.88 0 bottom
C30  76.77,54.6 0 bottom
C31  70.42,29.7 90 top
C32  53.4,26.78 90 top
C33  63.3,27.67 0 top
ESC1  29.46,11.18 0 top
ESC1_CON  4.4,10.99 270 top
ESC2  29.46,34.04 0 top
ESC2_CON  4.4,33.89 270 top
ESC3  29.46,56.9 0 top
ESC3_CON  4.4,56.89 270 top
J1  81.23,62.04 90 top
J2  73.58,62.13 90 top
J3  95.7,14.22 90 top
J5  107.37,38.85 270 top
JP1  74.61,48.13 0 top
JP2  74.66,45.54 0 top
JP3  74.65,43.02 0 top
JP4  74.66,40.43 0 top
JP5  74.68,37.85 0 top
JP6  74.71,35.32 0 top
JP7  109.02,6.97 0 bottom
JP8  109.15,4.43 0 top
JP9  106.48,4.43 0 top
JP10  100.26,16.12 0 top
JP11  100.26,13.07 0 top
JP12  87.4,46.99 0 top
JP13  86.52,54.01 0 top
JP14  86.65,56.61 0 top
JP15  100.26,10.53 0 top
JP16  106.48,6.97 0 top
JP17  103.94,4.43 0 top
JP18  109.02,1.89 0 top
JP19  106.48,1.89 0 top
JP20  103.94,1.89 0 top
JP21  101.4,1.89 0 top
JP22  98.86,1.89 0 top
LED1  72.45,24.12 180 top
LED2  65.46,24.12 180 top
LED3  58.1,24.24 180 top
PCB1  166.56,1.26 90 top
PS  99.75,38.47 0 bottom
PWM_HEADER  72.08,2.27 0 top
R1  64.4,31.57 270 top
R2  64.38,8.72 270 top
R3  64.37,54.22 270 top
R4  32.54,57.6 0 top
R5  28.97,57.61 0 top
R6  32.51,34.01 0 top
R7  28.52,34.01 0 top
R8  32.59,11.34 0 top
R9  28.48,11.34 0 top
R10  77.33,28.65 90 top
R15  108.01,14.46 90 bottom
R16  99.63,5.19 0 top
R17  99.75,6.84 0 top
R18  99.75,8.5 0 top
R19  110.17,36.31 180 bottom
R21  101.78,24.5 90 bottom
R22  96.54,26.78 0 bottom
R23  108.39,27.46 90 bottom
R24  101.91,28.22 90 bottom
R25  105.21,24.62 0 bottom
R26  99.12,21.58 0 bottom
RESET  80.6,27.2 270 top
SV2  87.05,3.29 0 top
U2  86.41,16.88 0 top
U4  105.09,14.46 270 top
U$1  65.03,14.61 270 top
U$2  65,37.56 270 top
U$3  64.99,60.13 270 top
U$4  80.24,40.01 270 top
U$5  98.86,55.87 0 top
U$6  98.74,24.5 270 bottom
U$7  105.21,27.42 270 bottom
U$8  98.99,31.99 90 top
Y2  77.73,14.48 90 top

### Tracks (layer width: path | path; a pad name or v marks a point on that pad's centre or on a via)
3.3V  (via drill 0.35)
  Top 0.508: U$5.VIN 90.06,60.86 C24.1 | 99.11,33.77 U$8.VOUT | U$8.VOUT 97.85,35.03 97.85,36.05 97.88,36.08 PS.P$1 | U$8.VOUT 99.11,33.77 | 99.11,33.77 C26.1 101.91,32.92 v101.91,32.24
  Bottom 0.508: R23.2 106.38,28.31 U$7.G 105.79,28.37 v101.91,32.24 99.84,30.17 U$6.G 99.94,25.35 R21.2 | PS.P$1 97.88,53.04 U$5.VIN
+5V  (via drill 0.35)
  Top 0.305: 66.95,34.73 U$2.VCC | 33.39,34.04 R6.2 33.44,33.92 | v83.62,15.73 82.17,15.73 U2.6 | U2.4 82.14,17.26 v83.62,17.26 83.62,19.8 83.5,19.8 82.86,20.43 82.48,20.43 v81.85,21.07 | v89.21,16.5 90.68,16.5 U2.20 | v89.21,14.97 90.61,14.97 U2.18 | 64.65,30.47 64.48,30.63 R1.2 | 64.65,7.61 R2.2 | U4.28 109.13,18.69 v109.15,18.67
  Top 0.508: C6.1 66.82,53.38 R3.2 64.32,53.32 64.32,52.31 62.29,50.28 54.92,50.28 52.38,47.74 35.11,47.74 | C6.1 70.45,53.29 71.43,52.31 | 12V-TO-5V.3 75.33,51.29 78.29,51.29 79.81,49.77 82.1,49.77 82.85,49.02 | 34.09,22.85 33.84,22.85 33.36,23.33 R6.2 33.36,45.98 35.11,47.74 | 64.32,30.47 64.48,30.63 | 34.09,22.85 33.44,22.19 R8.2 33.33,11.23 33.33,7.86 34.6,6.59 53.65,6.59 55.18,4.56 63.56,4.56 64.38,5.38 R2.2 66.75,7.87 | C5.1 66.85,30.72 R1.2 63.05,30.72 62.45,30.12 C33.1 | U$2.VCC 66.91,30.65 C5.1 | 66.75,7.87 C4.1 | U$1.VCC 66.93,8.06 66.75,7.87 | 35.11,47.74 33.59,49.26 33.59,57.4 R4.2 | 82.85,49.02 C10.1 82.9,44.5 U$4.VDD U$4.VREF 84.62,43.19 v84.64,43.17 87.05,43.17 96.39,33.83 U$8.VIN | U$3.VCC 66.91,57.32 C6.1 | JP12.1 87.4,47.65 85.28,49.77 83.6,49.77 82.85,49.02 | v79.69,33.26 77.33,30.91 R10.2 | U$8.VIN 96.32,32.87 v96.32,30.21 101.66,30.21 101.66,30.47 v101.78,30.47 104.2,30.47 | 104.2,30.47 109.15,25.51 v109.15,18.67 | J5.2 106.61,36.31 105.34,35.04 105.34,31.61 104.2,30.47 | C25.1 94.82,32.94 U$8.VIN | 34.09,22.85 50.31,22.85 C32.1 55.61,25.93 LED3.1-VDD 56.06,25.89 57.84,27.67 C33.1 | C33.1 62.45,26.32 LED2.1-VDD | LED1.1-VDD 70.16,25.93 69.91,26.18 69.91,27.04 70.42,27.55 C31.1 70.41,28.77 70.37,28.82 69.02,28.82 68.38,29.45 68.38,30.09 67.85,30.62 C5.1 | 62.41,27.71 C33.1
  Bottom 0.305: 83.54,15.65 v83.62,15.73 | C12.1 83.54,17.34 v83.62,17.26 v83.62,15.73 | C14.1 89.5,16.78 v89.21,16.5 v89.21,14.97 | C15.1 89.78,14.41 v89.21,14.97 | J3.2 88.69,11.68 86.93,13.45 86.93,14.72 | 86.93,14.72 87.18,14.97 v89.21,14.97 | 83.62,15.48 v83.62,15.73 | 83.62,15.48 84.13,14.97 86.67,14.97 86.93,14.72 | C13.1 83.29,15.14 83.62,15.48 | v109.15,18.67 108.11,18.67 C28.1
  Bottom 0.508: v81.85,21.07 83.12,22.34 83.12,32.24 82.1,33.26 | v84.64,43.17 84.64,42.91 83.12,41.39 83.12,34.28 82.1,33.26 | v79.69,33.26 82.1,33.26 | v96.32,30.21 95.69,29.58 R22.2 | v101.78,30.47 101.78,29.07 R24.2 | J5.2 R19.1
  pour Top: 71.43,52.31 71.43,50.02 76.51,50.02 76.51,52.31
+12V  (via drill 0.35, 0.8)
  Top 0.508: JP13.1 86.12,54.01 84.26,55.87 75.3,55.87 12V-TO-5V.1
  Top 0.813: 12V-TO-5V.1 72.98,55.84 v72.96,55.87
  other vias: 66.35,42.15 68.64,40.37 66.23,38.21 66.35,65.14 68.64,62.85 66.1,60.95 66.35,19.67 69.15,17.26 66.23,15.23
  pour Bottom (rank 4): 50.6,67.93 50.6,13.7 76.51,13.7 76.51,67.93
  pour Top (rank 3): 65.21,42.91 65.21,37.45 70.29,37.45 70.29,42.91
  pour Top (rank 3): 65.08,66.15 65.21,60.06 69.91,60.06 69.91,66.15
  pour Top (rank 3): 65.21,20.31 65.34,14.46 70.29,14.46 70.16,20.31
ANALOG_1  (via drill 0.35)
  Top 0.305: 77.52,43.17 U$4.CH1 77.56,43.17 78.67,43.17 79.18,43.67 79.18,45.2 76.25,48.13 JP1.1 73.6,49.13 v70.42,49.13 | v70.42,57.9 70.42,58.02 69.68,58.76 C3.2 68.56,58.91 66.1,58.91 65.63,58.44 65.63,57.94 65.59,57.9 65.59,57.36 U$3.VIOUT
  Bottom 0.305: v70.42,57.9 v70.42,49.13
ANALOG_2  (via drill 0.35)
  Top 0.305: R5.2 R4.1 v31.69,56.5 31.69,51.16 v32.57,50.28 | v49.08,46.47 61.27,46.47 62.29,47.48 72.71,47.48 JP2.1 74.66,45.02 76.13,43.55 76.13,42.53 76.77,41.9 77.52,41.9 U$4.CH2
  Bottom 0.305: v32.57,50.28 36.38,50.28 37.9,48.75 37.9,47.23 38.67,46.47 v49.08,46.47 | v31.69,56.5 31.69,57.52 C7.1
ANALOG_3  (via drill 0.35)
  Top 0.305: R8.1 v31.74,12.56 31.74,29.26 30.28,30.72 27.24,30.72 26.47,31.74 26.47,40.63 28.51,42.91 28.51,43.93 29.27,44.69 v32.06,44.69 | v49.08,45.45 61.78,45.45 62.8,46.47 71.2,46.47 JP3.1 74.65,42.49 76.51,40.63 77.52,40.63 U$4.CH3
  Top 0.508: R9.2 R8.1
  Bottom 0.305: v32.06,44.69 38.67,44.69 39.17,45.45 v49.08,45.45 | C9.1 31.71,12.53 v31.74,12.56
ANALOG_4  (via drill 0.35)
  Top 0.305: R7.2 R6.1 v31.66,35.29 31.66,42 v32.32,42.66 | v49.08,44.44 62.29,44.44 63.3,45.45 69.64,45.45 JP4.1 75.44,40.43 76.51,39.36 77.52,39.36 U$4.CH4
  Bottom 0.305: v32.32,42.66 37.9,42.66 39.68,44.44 v49.08,44.44 | C8.1 31.71,35.24 v31.66,35.29
ANALOG_5
  Top 0.305: U$2.VIOUT 65.64,35.85 65.97,36.18 68.91,36.18 C2.2 71.15,36.15 72.83,37.83 74.66,37.83 JP5.1 76.15,37.85 76.39,38.09 77.4,38.09 77.48,38.17 | 77.48,38.17 77.41,38.23 | 77.48,38.17 U$4.CH5
ANALOG_6
  Top 0.305: U$1.VIOUT 65.66,12.63 66.35,13.32 69.01,13.32 C1.2 71.02,13.29 72.45,14.59 72.45,32.92 JP6.1 74.89,35.32 76.39,36.82 77.4,36.82 77.48,36.9 | 77.48,36.9 77.44,36.94 | 77.48,36.9 U$4.CH6
CS  (via drill 0.35)
  Top 0.305: U2.14 v87.61,11.16 87.61,7.94 88.2,7.35 88.2,4.68 SV2.7 | v85.78,14.08 85.78,16.24 86.8,17.26 88.45,17.26 88.83,17.64 88.83,19.29 90.23,20.69 90.23,35.16 88.58,36.82 82.96,36.82 U$4.CS/SHDN
  Bottom 0.305: v87.61,11.16 86.8,11.16 85.78,12.18 v85.78,14.08
ESC1
  pour Top: 46.67,20.31 46.55,15.22 64.8,15.22 64.83,20.31
ESC2
  pour Top: 46.29,42.91 46.3,37.99 64.93,38.12 64.83,42.91
ESC3
  pour Top: 46.45,65.94 46.45,60.31 64.8,60.31 64.8,65.94
GND  (via drill 0.6)
  other vias: 29.01,2.53 36.63,2.53 36.63,5.07 29.01,7.61 29.01,27.93 29.01,19.04 29.01,39.36 29.01,46.98 29.01,54.6 29.01,63.49 36.63,63.49 36.63,58.41 36.63,52.06 42.98,58.41 42.98,63.49 107.75,66.03 100.13,66.03 100.13,58.41 100.13,46.98 107.75,46.98 103.94,22.85 107.75,22.85 92.51,20.31 92.51,26.66 81.08,31.74 79.81,27.93 70.92,11.42 69.65,8.88 49.46,21.45 41.46,32.5 38.41,35.16 41.97,42.02 35.11,19.93 38.16,19.93 84.39,34.4 84.64,18.66 95.18,5.83 81.72,6.21 82.61,10.4 77.78,22.59 78.92,19.16 92.77,43.55 77.66,53.2 81.72,51.04 83.88,53.71 59.62,8.5 54.41,8.37 56.95,11.54
  pour Top (rank 6): 26.21,68.09 118.7,68.09 119.4,67.39 118.3,-0.21 26.22,0.04 26.31,62.14
  pour Bottom (rank 6): 26.22,68.31 26.22,-0.01 118.42,-0.27 118.42,68.06
MISO  (via drill 0.35)
  Top 0.305: U2.16 89.21,8.15 90.84,6.13 90.84,4.58 SV2.9 | U2.16 89.21,13.48 88.91,13.78 88.91,14.01 88.32,14.59 88.32,15.68 v88.45,15.81 | v85.91,39.36 82.96,39.36 U$4.DOUT | U2.16 90.2,12.59 v91.88,10.91
  Bottom 0.305: v88.45,15.81 88.45,16.29 86.67,18.07 86.67,38.59 v85.91,39.36 | J3.1 96.96,11.67 96.96,10.65 96.45,10.15 92.64,10.15 v91.88,10.91
MOSI  (via drill 0.35)
  Top 0.305: SV2.8 89.47,3.42 89.47,6.84 88.41,8.16 U2.15 88.41,13.49 v87.64,13.96 87.64,15.28 v86.93,15.99 | U$4.DIN 82.96,38.09 v85.15,38.09
  Bottom 0.305: v87.64,13.96 89.41,13.96 89.76,13.6 90.07,13.6 91.24,12.43 92.64,12.43 J3.4 | v86.93,15.99 86.93,16.24 85.66,17.51 85.66,37.58 v85.15,38.09
N$1
  Top 2.54: ESC2_CON.C 9.69,28.81 ESC2.RED
N$2
  Top 0.305: U$1.FAULT R2.1
N$3
  Top 2.54: ESC2_CON.B 11.31,33.89 ESC2.YEL
N$4
  Top 0.305: U$2.FAULT 64.37,32.44 R1.1
N$5
  Top 2.54: ESC2_CON.A 9.39,38.97 ESC2.BLK
N$6
  Top 0.305: R3.1 64.36,55.09
  Top 0.508: U$3.FAULT 64.36,55.09 R3.1
N$7
  Top 2.54: ESC1_CON.C 9.73,5.91 ESC1.RED
N$8
  Top 2.54: ESC1_CON.B 11.27,10.99 ESC1.YEL
N$9
  Top 2.54: ESC1_CON.A 9.35,16.07 ESC1.BLK
N$10
  Top 2.54: ESC3_CON.C 9.55,51.81 ESC3.RED
N$11
  Top 2.54: ESC3_CON.B ESC3.YEL
N$12
  Top 2.54: ESC3_CON.A 9.53,61.97 ESC3.BLK
N$14
  Top 0.305: U2.7 82.08,14.85 79.69,14.85 77.73,16.81 Y2.2
  Bottom 0.305: Y2.2 77.47,17.29 C16.1
N$15
  Top 0.305: U2.8 79.56,14.08 79.43,13.96 79.43,13.65 Y2.1
  Bottom 0.305: 81.12,12.01 C17.1 | 81.12,12.01 81.06,11.94 | Y2.1 77.79,12.01 81.12,12.01
N$35  (via drill 0.35)
  Top 0.305: U4.23 108.09,15.35 v109.41,15.35
  Bottom 0.305: v109.41,15.35 109.37,15.31 R15.2
OUT1
  Top 0.305: LED2.4-DIN 67.91,24.71 68.51,24.12 69.53,24.12 69.91,23.73 69.91,22.56 LED1.2-DOUT
OUT2
  Top 0.305: LED3.4-DIN 60.55,24.97 61.15,24.37 62.54,24.37 62.92,23.99 62.92,22.56 LED2.2-DOUT
PB0
  Top 0.305: U2.12 86.01,6.24 86.93,5.32 86.93,3.16 SV2.6
PD3
  Top 0.305: U2.1 81.2,19.68 79.31,21.58 77.02,21.58 76.77,21.83 | SV2.2 80.7,2.65 74.23,9.13 74.23,19.67 76.13,21.58 76.51,21.58 76.77,21.83 | 76.77,21.83 76.77,25.26 76.26,25.77 LED1.4-DIN
PD4
  Top 0.305: U2.2 80.73,18.88 79.05,20.56 76.51,20.56 74.99,19.04 74.99,10.15 80.58,4.56 SV2.1
PD5
  Top 0.305: U2.9 83.61,7.33 83.12,6.84 83.12,4.68 SV2.3
PD6
  Top 0.305: U2.10 84.41,3.18 SV2.4
PD7
  Top 0.305: U2.11 85.21,5.13 SV2.5
PWM1  (via drill 0.35)
  Top 0.305: R18.1 96.58,8.5 v95.82,9.26 | v70.67,7.1 68.27,4.7 PWM_HEADER.1
  Bottom 0.305: PWM_HEADER.1 66.86,2.27 65.76,1.17 42.82,1.17 41.97,2.02 41.97,10.4 43.24,11.67 49.42,11.67 ESC1.PWM_SGN | v95.82,9.26 72.83,9.26 v70.67,7.1
PWM2  (via drill 0.35)
  Top 0.305: v44,2.27 v40.44,2.27 | R17.1 97.34,6.84 95.94,8.24 v95.82,8.24 | v73.84,6.72 72.19,6.72 71.05,5.57 71.05,2.51 PWM_HEADER.2
  Bottom 0.305: PWM_HEADER.2 70.81,4.42 70.42,4.81 67.88,4.81 65.34,2.27 v44,2.27 | v40.44,2.27 39.68,2.27 39.43,2.53 39.43,33.26 40.7,34.53 49.42,34.53 ESC2.PWM_SGN | v95.82,8.24 75.37,8.24 v73.84,6.72
PWM3  (via drill 0.35)
  Top 0.305: v41.21,13.19 v37.9,13.19 | v36.63,41.13 v36.63,46.21 | v36.13,49.01 36.13,49.52 37.4,50.79 41.71,50.79 45.78,54.85 45.78,56.37 46.79,57.39 49.42,57.39 ESC3.PWM_SGN | R16.1 97.72,5.19 v95.82,7.1
  Bottom 0.305: 73.35,4.17 PWM_HEADER.3 | 73.35,4.17 71.69,5.83 66.86,5.83 64.32,3.29 51.11,3.29 50.86,3.54 50.86,12.43 50.1,13.19 v41.21,13.19 | v37.9,13.19 37.14,13.19 36.63,13.7 v36.63,41.13 | v36.63,46.21 36.63,48.5 v36.13,49.01 | v95.82,7.1 76.28,7.1 73.35,4.17
PWM_CON_0
  Top 0.305: U4.6 104.87,15.44 105.59,14.72 105.59,9.38 103.18,6.97 101.91,6.97 101.53,6.59 101.53,6.25 R16.2
PWM_CON_1
  Top 0.305: R17.2 101.37,7.61 102.93,7.61 104.96,9.64 104.96,14.34 104.51,14.79 U4.7
PWM_CON_2
  Top 0.305: R18.2 103.06,8.5 104.2,9.64 104.2,13.83 103.89,14.14 U4.8
PWM_CON_3
  Top 0.305: U4.9 101.62,13.49 101.28,13.83 101.28,15.1 JP10.1
PWM_CON_4
  Top 0.305: U4.10 100.49,12.84 JP11.1
PWM_CON_5
  Top 0.305: U4.11 101.03,12.19 100.39,11.54 100.39,10.65 JP15.1
PWM_CON_6  (via drill 0.35)
  Top 0.305: U4.12 102.92,11.54 v103.31,11.92
  Bottom 0.305: v103.31,11.92 103.82,11.92 104.07,11.67 104.07,9.38 JP16.1
PWM_CON_7  (via drill 0.35)
  Top 0.305: U4.13 102.19,10.91 v103.31,10.91
  Bottom 0.305: v103.31,10.91 103.31,5.07 JP17.1
PWM_CON_8  (via drill 0.35)
  Top 0.305: U4.15 109.24,10.24 v109.28,10.27
  Bottom 0.305: v109.28,10.27 110.55,10.27 111.31,9.51 111.31,2.53 110.67,1.89 JP18.1
PWM_CON_9  (via drill 0.35)
  Top 0.305: U4.16 108.75,10.89 108.9,11.04 109.28,11.04 v109.53,11.29
  Bottom 0.305: JP19.1 106.74,1.89 108.01,3.16 109.91,3.16 110.42,3.67 110.42,7.86 108.39,9.89 108.39,10.53 109.15,11.29 v109.53,11.29
PWM_CON_10  (via drill 0.35)
  Top 0.305: U4.17 v106.87,11.54
  Bottom 0.305: v106.87,11.54 105.09,11.54 103.69,12.94 102.93,12.94 102.42,12.43 102.42,3.42 JP20.1
PWM_CON_11
  Top 0.305: U4.18 106.5,12.19 106.1,11.8 106.1,9 102.55,5.45 102.55,3.03 JP21.1
PWM_CON_12  (via drill 0.35)
  Top 0.305: U4.19 106.97,12.84 v106.61,13.19
  Bottom 0.305: v106.61,13.19 104.45,13.19 104.07,13.58 102.55,13.58 101.66,12.69 101.66,3.67 99.88,1.89 JP22.1
PWM_CON_13  (via drill 0.35)
  Top 0.305: U4.20 108.48,13.49 108.77,13.19 v109.41,13.19
  Bottom 0.305: v109.41,13.19 109.41,12.19 107.93,10.72 107.93,10.71 107.88,10.65 107.88,5.83 JP9.1
PWM_CON_14
  Top 0.305: 108.59,14.14 U4.21 108.59,14.14 | 108.59,14.14 108.9,13.83 109.79,13.83 110.17,13.45 110.17,8.75 109.66,8.24 108.39,8.24 107.75,7.61 107.75,5.83 JP8.1
PWM_CON_15
  Top 0.305: U4.22 108.83,14.79 109.02,14.59 110.55,14.59 110.8,14.34 110.8,7.35 110.42,6.97 JP7.1
RESET  (via drill 0.35)
  Top 0.305: U2.29 86.01,21.99 85.66,22.34 81.08,22.34 80.58,22.85 80.58,24.38 RESET.2 | RESET.2 79.59,24.4 | J3.5 93.78,19.95 93.78,27.67 93.02,28.43 v92.13,28.43 | RESET.2 80.6,26.43 82.61,28.43 v89.21,28.43 | RESET.2 78.77,24.4 78.42,24.75 78.42,27.55 78.16,27.8 R10.1 C11.2
  Bottom 0.305: v89.21,28.43 v92.13,28.43
SCK
  Top 0.305: U2.17 90.87,14.08 91.75,13.19 92.26,13.19 92.64,12.81 | U$4.CLK 82.96,40.63 86.67,40.63 90.86,36.43 90.86,30.59 91.88,29.58 93.28,29.58 94.29,28.56 94.29,20.31 94.8,19.8 97.59,19.8 98.36,19.04 98.36,15.61 J3.3 96.98,14.21 95.75,12.98 93.91,12.98 93.7,13.19 93.02,13.19 92.64,12.81 | SV2.10 90.86,2.27 92.13,3.54 92.13,9.38 92.64,9.89 92.64,12.81
SCL  (via drill 0.35)
  Top 0.305: v87.69,18.27 87.18,18.27 86.81,18.65 U2.28 86.81,23.74 87.31,24.24 v88.07,24.24
  Bottom 0.305: SV2.11 96.83,4.56 97.34,5.07 97.34,9.64 98.48,10.78 98.48,17.64 97.85,18.27 v87.69,18.27 | v88.07,24.24 88.7,24.24 arc-90 90.1,22.85 arc90 90.99,21.96 91.12,21.96 arc90 91.88,22.72 91.88,23.73 arc-90 92.77,24.62 93.15,24.62 arc-90 94.17,23.61 94.17,23.35 arc90 94.8,22.72 95.05,22.72 arc90 95.69,23.35 95.69,23.61 arc-90 96.58,24.5 97.39,24.5
  Bottom 0.508: R22.1 97.39,24.5 U$6.D 97.64,22.21 R26.2
SCL_PI  (via drill 0.35)
  Top 0.305: v104.33,18.02 104.96,17.39 U4.26 108.64,17.39 111.44,14.59 111.44,11.8 112.45,10.78 113.47,10.78 113.98,11.29 113.98,13.35 PCB1.P$5
  Top 0.508: U$5.SCL 99.13,41.63 PS.P$2
  Bottom 0.305: R26.1 100.09,21.7 v101.15,21.7 102.04,21.7 104.33,19.42 v104.33,18.02 | 99.94,23.65 99.94,23.72 98.83,24.82 98.83,36.34 99.12,36.62 PS.P$2
  Bottom 0.508: R21.1 99.94,23.65 U$6.S 99.97,23.42 R26.1
SDA  (via drill 0.35)
  Top 0.305: v87.69,19.29 arc-90 87.61,19.37 U2.27 87.61,21.88 89.21,23.48 v89.21,25.26 | v95.56,25.64 97.34,27.42 v100.77,27.42
  Bottom 0.305: v87.69,19.29 97.85,19.29 99.12,18.02 99.12,10.65 97.85,9.38 97.85,3.54 96.32,2.02 SV2.12 | 89.34,25.39 v89.21,25.26 89.59,25.64 v95.56,25.64 | v100.77,27.42 101.91,27.42
  Bottom 0.508: R24.1 101.91,27.42 U$7.D 104.11,24.62 R25.2
SDA_PI  (via drill 0.35)
  Top 0.305: PCB1.P$3 116.64,13.47 116.64,15.23 115.88,15.99 111.31,15.99 109.26,18.04 U4.27 107.99,18.02 106.87,18.02 105.98,18.91 v105.98,20.31
  Top 0.508: U$5.SDA 100.38,42.92 PS.P$3
  Bottom 0.305: R25.1 106.06,20.39 v105.98,20.31 | PS.P$3 100.39,38.46 100.39,36.05 105.21,31.23 107.63,31.23 109.53,29.32 109.53,27.8 108.39,26.66 R23.1 106.45,26.61 U$7.S
  Bottom 0.508: R25.1 106.06,26.22 U$7.S
SERVO_PWM
  Top 0.305: PCB1.P$12 111.59,22.31 110.93,22.97 110.93,30.21 J5.3
VCC
  Bottom 0.508: PCB1.P$4 PCB1.P$2 112.78,8.67 113.34,8.11 116.26,8.11 116.9,8.75 116.9,35.93 116.52,36.31 R19.2

### Text on the board
tPlace: GND | +12v | GND | IMU | +12V | Remove lin reg / before using / power from pi | A1 | A2 | +5V | A3 | Pressue Sensor | A4 | A5 | A6 | Servo | PWM1 | PWM2 | PWM3 | GND
bPlace: Bridge this to power / system from rasp pi | ESC Board Version1: / 11/11/2017 / Jacob Bobson / Luke McBee / Cynthia Zatlkowicz / Jason King